# EAGLE design countercat_current (EAGLE 6.5.0)
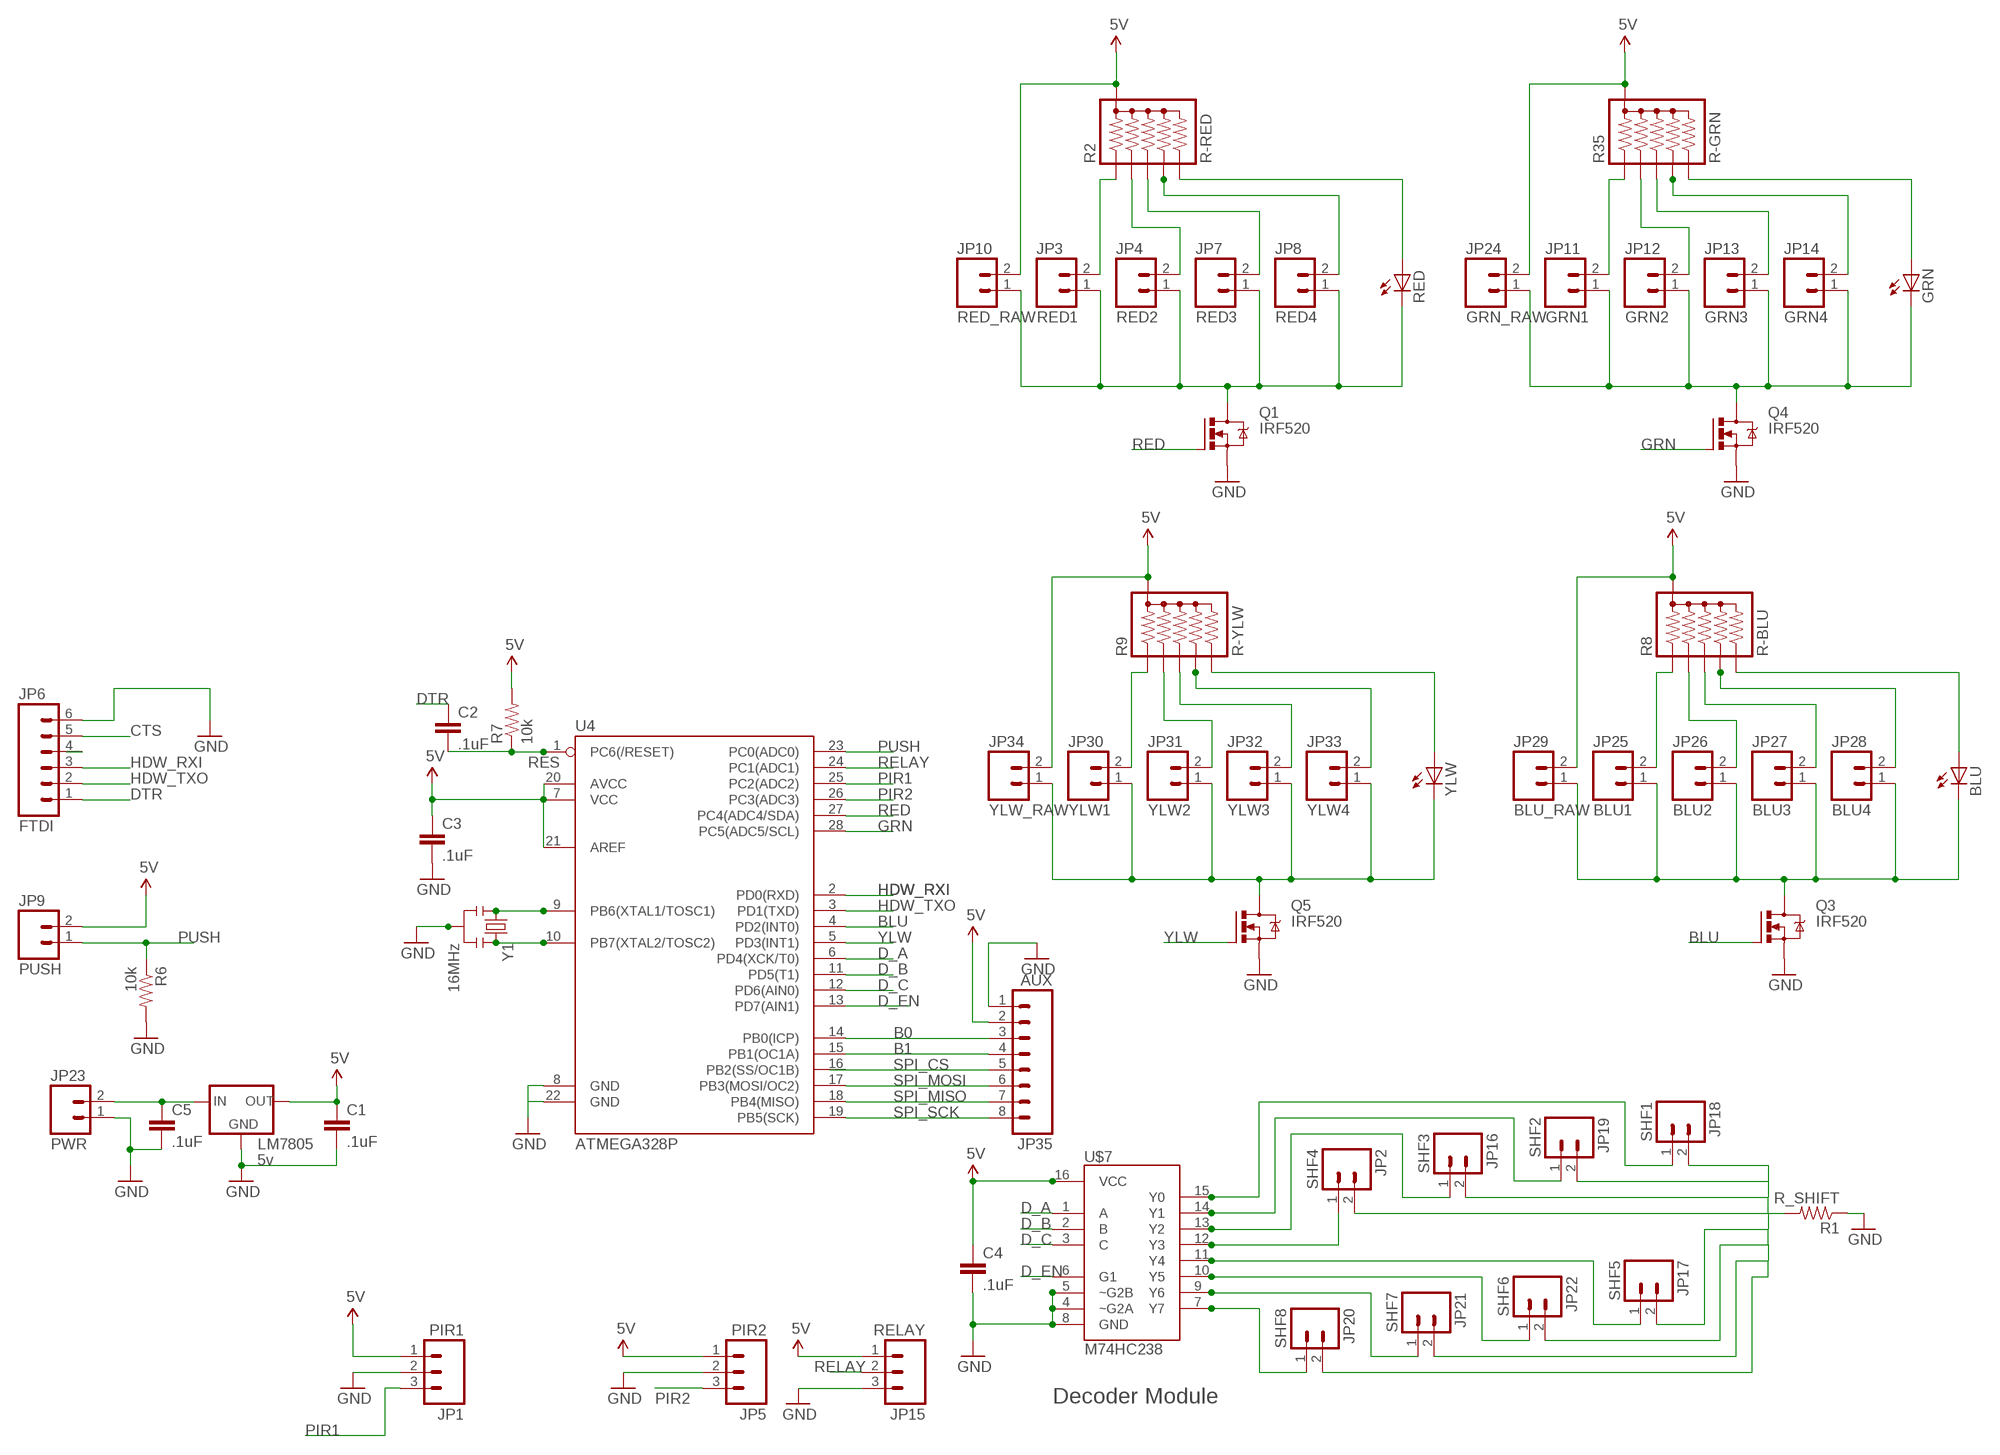
[diagram p0: schematic, sheet 1]

## Parts
BLU  LED3MM  [LED3MM]
C1  .1uF  CAPPTH2  [CAP-PTH-SMALL2]
C2  .1uF  CAPPTH2  [CAP-PTH-SMALL2]
C3  .1uF  CAPPTH2  [CAP-PTH-SMALL2]
C4  .1uF  CAPPTH2  [CAP-PTH-SMALL2]
C5  .1uF  CAPPTH2  [CAP-PTH-SMALL2]
GRN  LED3MM  [LED3MM]
JP1  PIR1  M03POLAR  [MOLEX-1X3]
JP2  SHF4  M02POLAR  [MOLEX-1X2]
JP3  RED1  M02POLAR  [MOLEX-1X2]
JP4  RED2  M02POLAR  [MOLEX-1X2]
JP5  PIR2  M03POLAR  [MOLEX-1X3]
JP6  FTDI  M06LOCK  [1X06_LOCK]
JP7  RED3  M02POLAR  [MOLEX-1X2]
JP8  RED4  M02POLAR  [MOLEX-1X2]
JP9  PUSH  M02POLAR  [MOLEX-1X2]
JP10  RED_RAW  M02POLAR  [MOLEX-1X2]
JP11  GRN1  M02POLAR  [MOLEX-1X2]
JP12  GRN2  M02POLAR  [MOLEX-1X2]
JP13  GRN3  M02POLAR  [MOLEX-1X2]
JP14  GRN4  M02POLAR  [MOLEX-1X2]
JP15  RELAY  M03POLAR  [MOLEX-1X3]
JP16  SHF3  M02POLAR  [MOLEX-1X2]
JP17  SHF5  M02POLAR  [MOLEX-1X2]
JP18  SHF1  M02POLAR  [MOLEX-1X2]
JP19  SHF2  M02POLAR  [MOLEX-1X2]
JP20  SHF8  M02POLAR  [MOLEX-1X2]
JP21  SHF7  M02POLAR  [MOLEX-1X2]
JP22  SHF6  M02POLAR  [MOLEX-1X2]
JP23  PWR  M02POLAR  [MOLEX-1X2]
JP24  GRN_RAW  M02POLAR  [MOLEX-1X2]
JP25  BLU1  M02POLAR  [MOLEX-1X2]
JP26  BLU2  M02POLAR  [MOLEX-1X2]
JP27  BLU3  M02POLAR  [MOLEX-1X2]
JP28  BLU4  M02POLAR  [MOLEX-1X2]
JP29  BLU_RAW  M02POLAR  [MOLEX-1X2]
JP30  YLW1  M02POLAR  [MOLEX-1X2]
JP31  YLW2  M02POLAR  [MOLEX-1X2]
JP32  YLW3  M02POLAR  [MOLEX-1X2]
JP33  YLW4  M02POLAR  [MOLEX-1X2]
JP34  YLW_RAW  M02POLAR  [MOLEX-1X2]
JP35  AUX  M08LOCK  [1X08_LOCK]
LM7805  5v  V_REG_78XXSINK  [TO220-IGO]
Q1  IRF520  [TO220BV]
Q3  IRF520  [TO220BV]
Q4  IRF520  [TO220BV]
Q5  IRF520  [TO220BV]
R1  R_SHIFT  RESISTORPTH-1/4W  [AXIAL-0.4]
R2  R-RED  RPACK-BUSSED-5-SIP-PTH-5  [RPACK-SIP-PTH-5]
R6  10k  RESISTORPTH-1/4W  [AXIAL-0.4]
R7  10k  RESISTORPTH-1/4W  [AXIAL-0.4]
R8  R-BLU  RPACK-BUSSED-5-SIP-PTH-5  [RPACK-SIP-PTH-5]
R9  R-YLW  RPACK-BUSSED-5-SIP-PTH-5  [RPACK-SIP-PTH-5]
R35  R-GRN  RPACK-BUSSED-5-SIP-PTH-5  [RPACK-SIP-PTH-5]
RED  LED3MM  [LED3MM]
U4  ATMEGA328P  ATMEGA328P_PDIP  [DIL28-3]
U$7  M74HC238  [DIL16]
Y1  16MHz  RESONATORPTH  [RESONATOR-PTH]
YLW  LED3MM  [LED3MM]

## Nets
5V: C1.1 C3.1 C4.1 JP1.1 JP5.1 JP9.2 JP10.2 JP15.1 JP24.2 JP29.2 JP34.2 JP35.2 LM7805.OUT R2.P$1 R7.P$2 R8.P$1 R9.P$1 R35.P$1 U4.7(VCC) U4.20(AVCC) U4.21(AREF) U$7.16(VCC)
B0: JP35.3 U4.14(PB0(ICP))
B1: JP35.4 U4.15(PB1(OC1A))
BLU: Q3.G U4.4(PD2(INT0))
CTS: JP6.5
D_A: U4.6(PD4(XCK/T0)) U$7.1(A)
D_B: U4.11(PD5(T1)) U$7.2(B)
D_C: U4.12(PD6(AIN0)) U$7.3(C)
D_EN: U4.13(PD7(AIN1)) U$7.6(G1)
DTR: C2.1 JP6.1
GND: C1.2 C3.2 C4.2 C5.2 JP1.2 JP5.2 JP6.6 JP15.3 JP23.1 JP35.1 LM7805.GND Q1.S Q3.S Q4.S Q5.S R1.P$1 R6.P$2 U4.8(GND) U4.22(GND) U$7.4(~G2A) U$7.5(~G2B) U$7.8(GND) Y1.2
GRN: Q4.G U4.28(PC5(ADC5/SCL))
HDW_RXI: JP6.3 U4.2(PD0(RXD))
HDW_TXO: JP6.2 U4.3(PD1(TXD))
N$1: JP17.1 U$7.11(Y4)
N$2: JP3.1 JP4.1 JP7.1 JP8.1 JP10.1 Q1.D RED.K(C)
N$3: U4.9(PB6(XTAL1/TOSC1)) Y1.1
N$4: GRN.K(C) JP11.1 JP12.1 JP13.1 JP14.1 JP24.1 Q4.D
N$5: JP11.2 R35.P$2
N$7: U4.10(PB7(XTAL2/TOSC2)) Y1.3
N$12: JP4.2 R2.P$3
N$13: JP12.2 R35.P$3
N$15: JP13.2 R35.P$4
N$16: JP14.2 R35.P$5
N$18: JP7.2 R2.P$4
N$19: JP8.2 R2.P$5
N$21: R2.P$6 RED.A
N$22: JP3.2 R2.P$2
N$25: JP2.2 JP16.2 JP17.2 JP18.2 JP19.2 JP20.2 JP21.2 JP22.2 R1.P$2
N$26: JP18.1 U$7.15(Y0)
N$27: JP19.1 U$7.14(Y1)
N$28: JP16.1 U$7.13(Y2)
N$29: JP2.1 U$7.12(Y3)
N$30: JP21.1 U$7.9(Y6)
N$31: JP22.1 U$7.10(Y5)
N$32: JP20.1 U$7.7(Y7)
N$33: JP6.4
N$34: BLU.K(C) JP25.1 JP26.1 JP27.1 JP28.1 JP29.1 Q3.D
N$35: JP26.2 R8.P$3
N$36: JP27.2 R8.P$4
N$37: JP28.2 R8.P$5
N$38: BLU.A R8.P$6
N$39: JP25.2 R8.P$2
N$40: JP30.1 JP31.1 JP32.1 JP33.1 JP34.1 Q5.D YLW.K(C)
N$41: JP31.2 R9.P$3
N$42: JP32.2 R9.P$4
N$43: JP33.2 R9.P$5
N$44: R9.P$6 YLW.A
N$45: GRN.A R35.P$6
N$46: JP30.2 R9.P$2
PIR1: JP1.3 U4.25(PC2(ADC2))
PIR2: JP5.3 U4.26(PC3(ADC3))
PUSH: JP9.1 R6.P$1 U4.23(PC0(ADC0))
RED: Q1.G U4.27(PC4(ADC4/SDA))
RELAY: JP15.2 U4.24(PC1(ADC1))
RES: C2.2 R7.P$1 U4.1(PC6(/RESET))
SPI_CS: JP35.5 U4.16(PB2(SS/OC1B))
SPI_MISO: JP35.7 U4.18(PB4(MISO))
SPI_MOSI: JP35.6 U4.17(PB3(MOSI/OC2))
SPI_SCK: JP35.8 U4.19(PB5(SCK))
VB: C5.1 JP23.2 LM7805.IN
YLW: Q5.G U4.5(PD3(INT1))

## Notes on the sheet
- Decoder Module

## Library data of the parts
BLU GRN RED YLW = SparkFun-LED:LED: LEDs Standard schematic elements and footprints for 5mm, 3mm, 1206, and 0603 sized LEDs. 5mm - Spark Fun Electronics SKU : COM-00529 (and others)
C1-C5 = SparkFun-Capacitors:CAP: Capacitor Standard 0603 ceramic capacitor, and 0.1" leaded capacitor.
JP1 JP5 JP15 = SparkFun:M03: Header 3 Standard 3-pin 0.1" header. Use with straight break away headers (SKU : PRT-00116), right angle break away headers (PRT-00553), swiss pins (PRT-00743), machine pins (PRT-00117), and female headers (PRT-00115). Molex polarized connector foot print use with SKU : PRT-08232 with associated crimp pins and housings.
JP2-JP4 JP7-JP14 JP16-JP34 = SparkFun:M02: Header 2 Standard 2-pin 0.1" header. Use with straight break away headers (SKU : PRT-00116), right angle break away headers (PRT-00553), swiss pins (PRT-00743), machine pins (PRT-00117), and female headers (PRT-00115). Molex polarized connector foot print use with SKU : PRT-08233 with associated crimp pins and housings.
JP6 = NickDC2011Breakouts:M06: Header 6 Standard 6-pin 0.1" header. Use with straight break away headers (SKU : PRT-00116), right angle break away headers (PRT-00553), swiss pins (PRT-00743), machine pins (PRT-00117), and female headers (PRT-00115). Molex polarized connector foot print use with SKU : PRT-08094 with associated crimp pins and housings. NOTES ON THE VARIANTS LOCK and LOCK_LONGPADS... This footprint was designed to help hold the alignment of a through-hole component (i.e. 6-pin header) while soldering it into place. You may notice that each hole has been shifted either up or down by 0.005 of an inch from it's more standard position (which is a perfectly straight line). This slight alteration caused the pins (the squares in the middle) to touch the edges of the holes. Because they are alternating, it causes a "brace" to hold the component in place. 0.005 has proven to be the perfect amount of "off-center" position when using our standard breakaway headers. Although looks a little odd when you look at the bare footprint, once you have a header in there, the alteration is very hard to notice. Also, if you push a header all the way into place, it is covered up entirely on the bottom side. This idea of altering the position of holes to aid alignment will be further integrated into the Sparkfun Library for other footprints. It can help hold any component with 3 or more connection pins.
JP35 = SparkFun-Connectors:M08: Header 8 Standard 8-pin 0.1" header. Use with straight break away headers (SKU : PRT-00116), right angle break away headers (PRT-00553), swiss pins (PRT-00743), machine pins (PRT-00117), and female headers (PRT-00115).
LM7805 = SparkFun-PowerIC:V_REG_78XX: Voltage Regulator Standard 7805 5V regulator. IGO (Input Ground Output). Spark Fun Electronics SKU : COM-00107
Q1 Q3-Q5 = transistor-power:IRF520: HEXFET Power MOSFET
R1 R6 R7 = SparkFun-Resistors:RESISTOR: Resistor Basic schematic elements and footprints for 0603, 1206, and PTH resistors.
R2 R8 R9 R35 = SparkFun-Resistors:RPACK-BUSSED-5: BOURNS 4600X series thick-film SIP resistor packs Five resistors bussed to a single pin (denoted by dot). 0.2W / resistor datasheet <http://dlnmh9ip6v2uc.cloudfront.net/datasheets/Components/General/4600x.pdf> SFE parts COM-10855 (330), COM-10856 (10K)
U4 = SparkFun-DigitalIC:ATMEGA328P_PDIP: uC used in the Arduino 32kb flash, 1k EEPROM, 2k SRAM This is the through-hole version of this chip.
U$7 = SparkFun-DigitalIC:M74HC238: M74HC238 - CMOS 3 TO 8 LINE DECODER
Y1 = SparkFun-FreqCtrl:RESONATOR: Resonator Small SMD resonator. Used, eg, on the Arduino Pro/ Pro Mini boards. 8MHz- XTAL-08895 16MHz- XTAL-08900

## Board
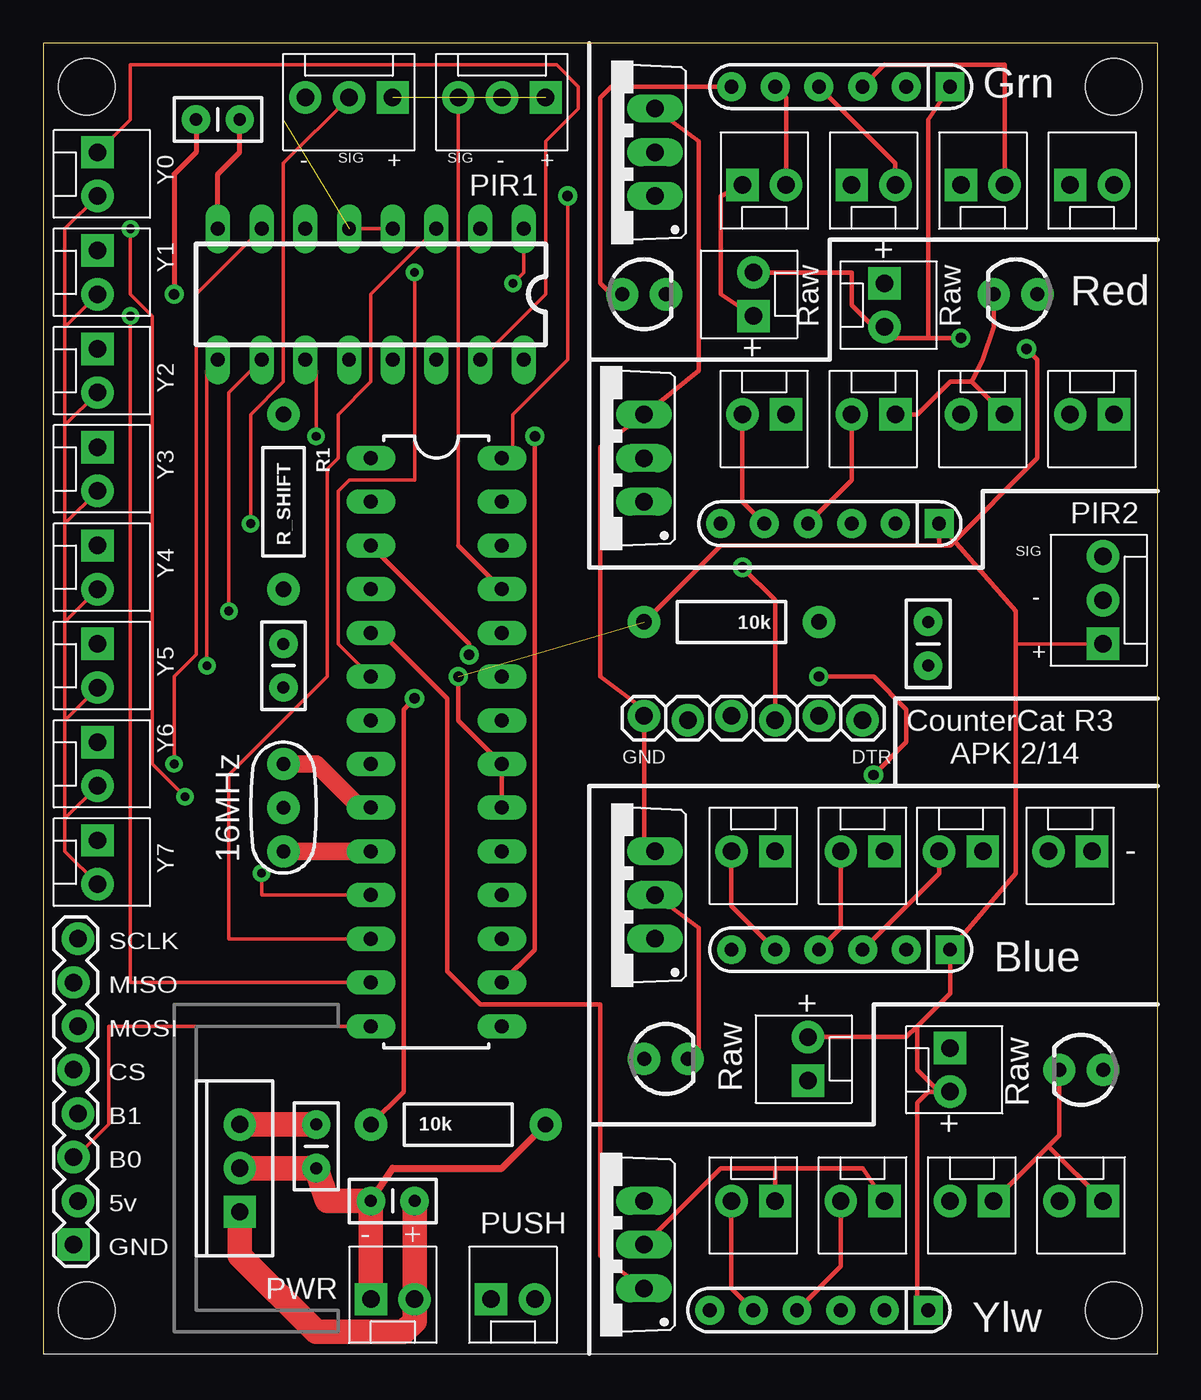
[diagram p1: board, top side]
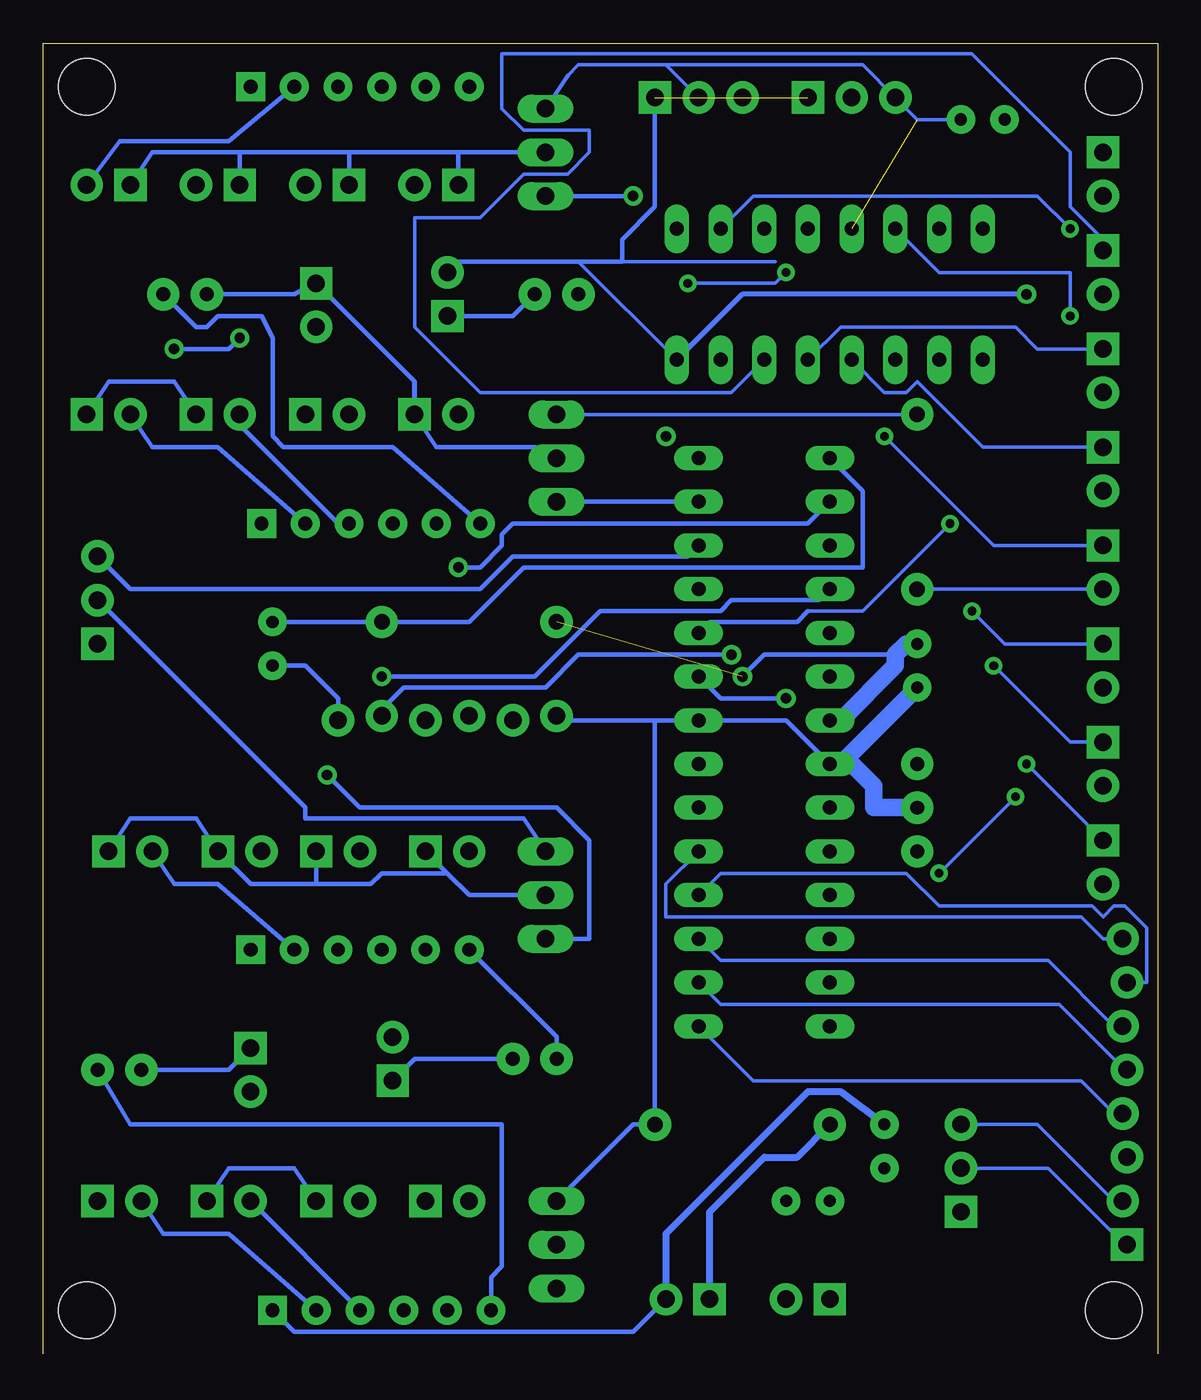
[diagram p2: board, bottom side, seen from below]

Size 64.77 x 76.2 mm. Coordinates in mm from the lower left corner, seen from the top.
Outline: 64.77,0 64.77,76.2 0,76.2 0,0
Copper layers (1*16): Top 0.035mm / dielectric 1.5mm / Bottom 0.035mm
Design rules "DesignRules": minimum track width 8mil, minimum drill 20mil, track to track 10mil, track to pad 10mil, pad to pad 10mil, via to via 10mil, smd to smd 8mil, copper to edge 10mil, drill to drill 8mil, minimum pad ring 12mil, minimum via ring 10mil, stop-mask expansion 4mil, vias tented up to drill 25mil, thermal gap 10mil
Holes 3.26 mm at 62.23,73.66 2.54,73.66 62.23,2.54 2.54,2.54

### Footprints (pad centres in the part's own frame; a part is rotated, then mirrored left to right if it is on the bottom)
LED3MM = drill 0.813 pad 1.88: A -1.27,0; K 1.27,0
CAP-PTH-SMALL2 = drill 0.7 pad 1.651: 1 0,0; 2 2.54,0
MOLEX-1X3 = drill 1.016 pad 1.88 square: 1 0,0 | drill 1.016 pad 1.88: 2 2.54,0; 3 5.08,0
MOLEX-1X2 = drill 1.016 pad 1.88 square: 1 0,0 | drill 1.016 pad 1.88: 2 2.54,0
1X06_LOCK = drill 1.016 pad 1.88: 1 0,0; 2 2.54,-0.254; 3 5.08,0; 4 7.62,-0.254; 5 10.16,0; 6 12.7,-0.254
1X08_LOCK = drill 1.016 pad 1.88 square: 1 0,0.127 | drill 1.016 pad 1.88: 2 2.54,-0.127; 3 5.08,0.127; 4 7.62,-0.127; 5 10.16,0.127; 6 12.7,-0.127; 7 15.24,0.127; 8 17.78,-0.127
TO220-IGO = drill 1 pad 1.88: GND 0,0; OUT 2.54,0 | drill 1 pad 1.88 square: IN -2.54,0
TO220BV = drill 1.016 long: D 0,-2.54; G -2.54,-2.54; S 2.54,-2.54
AXIAL-0.4 = drill 0.9 pad 1.88: P$1 -5.08,0; P$2 5.08,0
RPACK-SIP-PTH-5 = drill 0.8 pad 1.676 square: P$1 0,0 | drill 0.8 pad 1.676: P$2 0,-2.54; P$3 0,-5.08; P$4 0,-7.62; P$5 0,-10.16; P$6 0,-12.7
DIL28-3 = drill 0.813 long: 1 -16.51,-3.81; 2 -13.97,-3.81; 3 -11.43,-3.81; 4 -8.89,-3.81; 5 -6.35,-3.81; 6 -3.81,-3.81; 7 -1.27,-3.81; 8 1.27,-3.81; 9 3.81,-3.81; 10 6.35,-3.81; 11 8.89,-3.81; 12 11.43,-3.81; 13 13.97,-3.81; 14 16.51,-3.81; 15 16.51,3.81; 16 13.97,3.81; 17 11.43,3.81; 18 8.89,3.81; 19 6.35,3.81; 20 3.81,3.81; 21 1.27,3.81; 22 -1.27,3.81; 23 -3.81,3.81; 24 -6.35,3.81; 25 -8.89,3.81; 26 -11.43,3.81; 27 -13.97,3.81; 28 -16.51,3.81
DIL16 = drill 0.813 long: 1 -8.89,-3.81; 2 -6.35,-3.81; 3 -3.81,-3.81; 4 -1.27,-3.81; 5 1.27,-3.81; 6 3.81,-3.81; 7 6.35,-3.81; 8 8.89,-3.81; 9 8.89,3.81; 10 6.35,3.81; 11 3.81,3.81; 12 1.27,3.81; 13 -1.27,3.81; 14 -3.81,3.81; 15 -6.35,3.81; 16 -8.89,3.81
RESONATOR-PTH = drill 0.8 pad 1.88: 1 -2.54,0; 2 0,0; 3 2.54,0

### Placement (x,y rotation side)
BLU  36.2,17.14 0 top
C1  15.88,13.34 270 top
C2  51.44,40.01 90 top
C3  13.97,41.27 270 top
C4  8.89,71.75 0 top
C5  21.59,8.89 180 top
GRN  34.92,61.59 0 top
JP1  29.21,73.03 180 top
JP2  3.17,52.7 270 top
JP3  62.23,54.61 180 top
JP4  55.88,54.61 180 top
JP5  61.59,41.27 90 top
JP6  47.62,36.83 180 top
JP7  49.53,54.61 180 top
JP8  43.18,54.61 180 top
JP9  26.04,3.17 0 top
JP10  48.9,62.23 270 top
JP11  59.69,67.94 0 top
JP12  53.34,67.94 0 top
JP13  46.99,67.94 0 top
JP14  40.64,67.94 0 top
JP15  20.32,73.03 180 top
JP16  3.17,58.42 270 top
JP17  3.17,46.99 270 top
JP18  3.17,69.85 270 top
JP19  3.17,64.14 270 top
JP20  3.17,29.84 270 top
JP21  3.17,35.56 270 top
JP22  3.17,41.27 270 top
JP23  19.05,3.17 0 top
JP24  41.27,60.33 90 top
JP25  60.96,29.21 180 top
JP26  54.61,29.21 180 top
JP27  48.9,29.21 180 top
JP28  42.55,29.21 180 top
JP29  44.45,15.88 90 top
JP30  61.59,8.89 180 top
JP31  55.24,8.89 180 top
JP32  48.9,8.89 180 top
JP33  42.55,8.89 180 top
JP34  52.7,17.78 270 top
JP35  1.91,6.35 90 top
LM7805  11.43,10.79 90 top
Q1  32.38,52.07 90 top
Q3  33.02,26.67 90 top
Q4  33.02,69.85 90 top
Q5  32.38,6.35 90 top
R1  13.97,49.53 270 top
R2  52.07,48.26 270 top
R6  24.13,13.34 0 top
R7  40.01,42.55 180 top
R8  52.7,23.5 270 top
R9  51.44,2.54 270 top
R35  52.7,73.66 270 top
RED  56.52,61.59 180 top
U4  22.86,35.56 270 top
U$7  19.05,61.59 180 top
Y1  13.97,31.75 270 top
YLW  60.33,16.51 180 top

### Tracks (layer width: path | path; a pad name or v marks a point on that pad's centre or on a via)
5V  (via drill 0.6, 0.61)  (2 unrouted)
  Top 0.203: 56.52,41.27 JP5.1
  Top 0.254: R35.P$1 51.44,71.75 51.44,59.05 | JP24.2 46.99,62.87 46.99,60.96 48.26,59.69 JP10.2 49.53,59.05 51.44,59.05 | R7.P$2 39.37,46.99 52.07,46.99 | 52.07,46.99 R2.P$1 56.52,43.18 56.52,41.27 56.52,27.94 R8.P$1 52.7,20.95 50.8,19.05 | 52.07,46.99 52.7,46.99 57.78,52.07 57.78,57.78 v57.15,58.42 | v53.34,59.05 51.44,59.05 | 50.8,19.05 50.8,16.51 52.07,15.24 JP34.2 51.44,15.24 50.8,14.61 50.8,3.17 R9.P$1 | JP29.2 50.16,18.41 50.8,19.05 | U4.20 U4.21 24.13,36.83 v24.13,39.37
  Top 0.305: C4.1 8.89,69.85 7.62,68.58 v7.62,61.59
  Top 1.422: LM7805.OUT C1.1
  Bottom 0.203: 33.66,63.5 U$7.16 | LM7805.OUT 6.99,13.34 2.54,8.89 JP35.2 | 31.11,63.5 22.23,63.5
  Bottom 0.254: JP9.2 30.48,1.27 50.16,1.27 R9.P$1 | JP1.1 29.21,66.67 31.11,64.77 31.11,63.5 33.66,63.5 40.64,63.5 JP24.2 | v57.15,58.42 53.98,58.42 v53.34,59.05 | v24.13,39.37 22.86,40.64 15.24,40.64
  Bottom 0.305: v7.62,61.59 24.13,61.59 U$7.16
  Bottom 0.406: C1.1 18.41,15.24 20.32,15.24 28.57,6.99 JP9.2
  Bottom 1.016: U4.7 18.41,36.83 15.24,40.01 15.24,40.64 14.61,41.27 C3.1
B0
  Top 0.203: U4.14 3.81,19.05 3.81,13.34 1.91,11.43 JP35.3
B1
  Bottom 0.203: U4.15 23.5,15.88 4.45,15.88 2.54,13.97 JP35.4
BLU  (via drill 0.6)
  Top 0.254: v45.09,39.37 48.26,39.37 50.16,37.47 50.16,35.56 v48.26,33.66
  Bottom 0.254: U4.4 19.68,43.81 24.77,43.81 25.4,43.18 32.38,43.18 36.2,39.37 v45.09,39.37 | Q3.G 33.02,24.13 33.02,29.84 34.92,31.75 46.35,31.75 v48.26,33.66
D_A  (via drill 0.51)
  Top 0.203: U4.6 17.14,41.27 17.14,50.16 17.78,50.8 21.59,50.8 v21.59,62.87 | v27.3,62.23 27.94,62.87 U$7.1
  Bottom 0.203: v21.59,62.87 22.23,62.23 v27.3,62.23
D_B  (via drill 0.51)
  Top 0.203: U4.11 12.7,26.67 v12.7,27.94 | v8.26,32.38 6.35,34.29 6.35,60.33 5.08,61.59 v5.08,65.41
  Bottom 0.203: v8.26,32.38 v12.7,27.94 | v5.08,65.41 6.99,67.31 23.5,67.31 U$7.2
D_C
  Top 0.203: U4.12 10.79,24.13 10.79,33.66 16.51,39.37 16.51,51.44 17.14,52.07 17.14,54.61 19.05,56.52 19.05,61.59 U$7.3
D_EN  (via drill 0.51)
  Top 0.203: U4.13 5.08,21.59 v5.08,60.33
  Bottom 0.203: v5.08,60.33 5.08,62.87 12.7,62.87 U$7.6
DTR
  Bottom 0.254: JP6.1 47.62,38.1 49.53,40.01 C2.1
GND  (1 unrouted)
  Top 0.203: U$7.4 U$7.5
  Top 0.254: Q3.S 34.92,29.84 JP6.6 34.92,37.47 32.38,39.37 32.38,52.7 Q1.S 38.1,57.15 38.1,70.48 Q4.S
  Top 0.305: U$7.8 10.16,68.58 11.43,69.85 C4.2
  Top 0.406: C5.2 20.32,10.79 26.67,10.79 R6.P$2
  Top 1.422: LM7805.GND C1.2 16.51,8.89 C5.2 JP23.1
  Bottom 0.203: LM7805.GND 6.35,10.79 1.91,6.35 JP35.1 | Q1.S R1.P$1 | 28.57,74.93 JP1.2 | 28.57,74.93 33.66,74.93 34.29,74.3 | C4.2 13.97,71.75 JP15.3 17.14,74.93 28.57,74.93
  Bottom 0.254: 18.41,34.29 U4.8 21.59,36.83 U4.22 29.21,36.83 | 34.29,74.3 Q4.S | Q5.S 30.48,13.34 R6.P$2 29.21,36.83 | 29.21,36.83 34.92,36.83 JP6.6 | Q3.S 36.83,31.11 49.53,31.11 49.53,31.75 JP5.2
  Bottom 1.016: Y1.2 16.51,31.75 16.51,33.02 18.1,34.61 | C3.2 18.1,34.61 | 18.1,34.61 18.41,34.29
GRN  (via drill 0.6)
  Top 0.203: 27.3,52.7 27.3,54.61 30.48,57.78 v30.48,67.31
  Top 0.254: 27.3,52.7 U4.28
  Bottom 0.254: v30.48,67.31 Q4.G
HDW_RXI  (via drill 0.61)
  Top 0.254: JP6.3 42.55,43.81 v40.64,45.72
  Bottom 0.254: U4.2 20.32,48.26 37.47,48.26 38.1,47.62 38.1,46.99 39.37,45.72 v40.64,45.72
HDW_TXO  (via drill 0.61)
  Top 0.254: U4.3 24.77,41.27 v24.77,40.64
  Bottom 0.254: v24.77,40.64 33.66,40.64 35.56,38.73 43.81,38.73 45.09,37.47 JP6.2
N$1  (via drill 0.51)
  Top 0.203: U$7.11 15.88,57.15 v15.88,53.34
  Bottom 0.203: v15.88,53.34 9.53,46.99 JP17.1
N$2
  Top 0.254: JP7.1 50.8,54.61 52.7,56.52 53.98,56.52 | 53.98,56.52 JP4.1 | 53.98,56.52 54.61,57.78 55.24,59.69 RED.K
  Bottom 0.254: Q1.D 36.2,52.7 41.91,52.7 JP8.1 | JP3.1 60.96,56.52 57.15,56.52 JP4.1 | RED.K 50.16,61.59 JP10.1 43.18,56.52
  Bottom 0.305: JP8.1 43.18,56.52
N$3
  Top 1.016: Y1.1 15.88,34.29 18.41,31.75 U4.9
N$4
  Top 0.254: JP24.1 39.37,61.59 39.37,67.31 JP14.1
  Bottom 0.254: GRN.K 37.47,60.33 JP24.1 | Q4.D 40.64,69.85 | 40.64,69.85 46.99,69.85 | 46.99,69.85 53.34,69.85 | JP11.1 58.42,69.85 53.34,69.85 | 53.34,69.85 JP12.1 | JP13.1 46.99,69.85 | JP14.1 40.64,69.85
N$5
  Bottom 0.254: R35.P$2 53.98,70.48 60.33,70.48 JP11.2
N$7
  Top 1.016: Y1.3 U4.10
N$12
  Bottom 0.254: R2.P$3 47.62,48.26 53.34,53.98 JP4.2
N$13
  Top 0.254: R35.P$3 48.9,74.93 55.88,74.93 JP12.2
N$15
  Top 0.254: R35.P$4 49.53,69.22 JP13.2
N$16
  Top 0.254: R35.P$5 43.18,73.03 JP14.2
N$18
  Top 0.254: R2.P$4 46.99,50.8 JP7.2
N$19
  Top 0.254: R2.P$5 40.64,49.53 JP8.2
N$21
  Bottom 0.254: R2.P$6 44.45,52.7 50.8,52.7 51.44,53.34 51.44,59.05 52.07,60.33 54.61,60.33 55.24,59.69 55.88,59.69 RED.A
N$22
  Bottom 0.254: R2.P$2 54.61,52.7 58.42,52.7 JP3.2
N$25
  Top 0.203: JP20.2 1.27,29.21 1.27,31.11 | JP21.2 1.27,31.11 | 1.27,36.83 JP22.2 | 1.27,31.11 1.27,36.83 | 1.27,42.55 JP17.2 | 1.27,36.83 1.27,42.55 | 1.27,48.26 JP2.2 | 1.27,42.55 1.27,48.26 | 1.27,53.98 JP16.2 | 1.27,48.26 1.27,53.98 | 1.27,59.69 JP19.2 | 1.27,53.98 1.27,59.69 | JP18.2 1.27,65.41 1.27,59.69
  Bottom 0.203: JP17.2 R1.P$2
N$26
  Top 0.203: JP18.1 5.08,71.75 5.08,74.93 29.84,74.93 31.11,73.66 31.11,72.39 29.21,70.48 29.21,61.59 U$7.15
N$27
  Bottom 0.203: U$7.14 24.77,55.88 39.37,55.88 43.18,59.69 43.18,66.04 39.37,66.04 36.83,68.58 34.29,68.58 33.02,69.85 33.02,71.12 36.83,71.12 38.1,72.39 38.1,75.56 10.79,75.56 5.08,69.85 5.08,66.67 3.17,64.77 JP19.1
N$28
  Bottom 0.203: U$7.13 18.41,59.69 8.26,59.69 6.99,58.42 JP16.1
N$29
  Bottom 0.203: U$7.12 15.88,55.88 14.61,55.88 13.97,56.52 10.16,52.7 JP2.1
N$30  (via drill 0.51)
  Top 0.203: U$7.9 9.53,57.15 v9.53,40.01
  Bottom 0.203: v9.53,40.01 5.08,35.56 JP21.1
N$31  (via drill 0.51)
  Top 0.203: U$7.10 10.79,55.88 v10.79,43.18
  Bottom 0.203: v10.79,43.18 8.89,41.27 JP22.1
N$32  (via drill 0.51)
  Top 0.203: v7.62,34.29 7.62,39.37 8.89,40.64 8.89,61.59 U$7.7
  Bottom 0.203: JP20.1 v7.62,34.29
N$34
  Top 0.254: Q3.D 38.1,24.77 38.1,17.78 BLU.K
  Bottom 0.254: JP29.1 43.18,17.14 BLU.K | 41.27,27.94 40.01,26.67 Q3.D | 41.27,27.94 JP28.1 | JP25.1 59.69,31.11 55.88,31.11 JP26.1 52.7,27.3 48.9,27.3 | 41.27,27.94 45.09,27.94 45.72,27.3 48.9,27.3 | JP27.1 48.9,27.3
N$35
  Top 0.254: R8.P$3 52.07,27.94 JP26.2
N$36
  Top 0.254: R8.P$4 46.35,24.77 JP27.2
N$37
  Top 0.254: R8.P$5 40.01,26.04 JP28.2
N$38
  Bottom 0.254: R8.P$6 34.92,18.41 BLU.A
N$39
  Bottom 0.254: R8.P$2 54.61,27.3 57.15,27.3 JP25.2
N$40
  Top 0.254: Q5.D 39.37,10.79 42.55,10.79 | JP33.1 42.55,10.79 | JP32.1 47.62,10.79 42.55,10.79 | 58.42,12.06 59.05,12.7 YLW.K | 58.42,12.06 JP31.1 | 58.42,12.06 JP30.1
  Bottom 0.254: JP34.1 53.98,16.51 YLW.K | JP32.1 50.16,10.79 53.98,10.79 JP31.1
N$41
  Bottom 0.254: JP31.2 R9.P$3
N$42
  Top 0.254: R9.P$4 46.35,5.08 JP32.2
N$43
  Top 0.254: R9.P$5 40.01,3.81 JP33.2
N$44
  Bottom 0.254: YLW.A 59.69,13.34 38.1,13.34 38.1,5.08 38.73,4.45 R9.P$6
N$45
  Top 0.254: R35.P$6 33.02,73.66 32.38,73.03 32.38,62.23 33.02,61.59 GRN.A
N$46
  Bottom 0.254: R9.P$2 53.98,6.99 57.78,6.99 JP30.2
PIR1
  Top 0.203: JP1.3 24.13,46.99
  Top 0.254: 24.13,46.99 U4.25
PIR2
  Bottom 0.254: U4.26 27.3,46.35 37.47,46.35 39.37,44.45 59.69,44.45 JP5.3
PUSH  (via drill 0.61)
  Top 0.254: v21.59,38.1 20.95,37.47 20.95,15.24 R6.P$1
  Bottom 0.254: U4.23 25.4,38.1 v21.59,38.1
  Bottom 0.406: JP9.1 26.04,8.26 22.86,11.43 20.95,11.43 R6.P$1
RED
  Bottom 0.254: Q1.G U4.27
RELAY  (via drill 0.51)
  Top 0.203: v12.06,48.26 12.06,54.61 13.97,56.52 13.97,69.22 JP15.2
  Bottom 0.203: v12.06,48.26 17.14,43.18 20.32,43.18
  Bottom 0.254: U4.24 26.04,42.55 20.95,42.55 20.32,43.18
RES
  Bottom 0.254: C2.2 R7.P$1 40.01,42.55 36.83,45.72 17.14,45.72 17.14,50.16 U4.1
SPI_CS  (via drill 0.61)
  Top 0.254: U4.16 28.57,23.5 v28.57,53.34
  Bottom 0.203: U4.16 25.4,20.32 5.71,20.32 1.91,16.51 JP35.5
SPI_MISO
  Bottom 0.203: U4.18 25.4,27.94 14.61,27.94 12.7,26.04 3.81,26.04 3.17,25.4 2.54,26.04 1.91,26.04 0.64,24.77 0.64,21.59 JP35.7
SPI_MOSI
  Bottom 0.203: U4.17 25.4,22.86 6.35,22.86 2.54,19.05 JP35.6
SPI_SCK
  Bottom 0.203: U4.19 28.57,27.3 28.57,25.4 4.45,25.4 3.17,24.13 JP35.8
VB
  Top 1.422: LM7805.IN 11.43,5.71 15.88,1.27 20.95,1.27 21.59,1.91 JP23.2 C5.1
YLW
  Top 0.254: Q5.G 32.38,5.71 32.38,20.32 25.4,20.32 23.5,22.23 23.5,38.1 19.68,41.91 U4.5

### Text on the board
tPlace: SCLK | MISO | MOSI | CS | B1 | B0 | 5v | GND
tNames: Grn | - | SIG | + | SIG | - | + | Y0 | PIR1 | + | Y1 | Red | Raw | Raw | + | Y2 | Y3 | PIR2 | SIG | Y4 | - | + | Y5 | CounterCat R3 | Y6 | GND | DTR | APK 2/14 | 16MHz | - | Y7 | Blue | + | Raw | Raw | + | PUSH | - | + | PWR | Ylw
tValues: RELAY